# Altium project PCB_Project_sup_ca-.PrjPcb
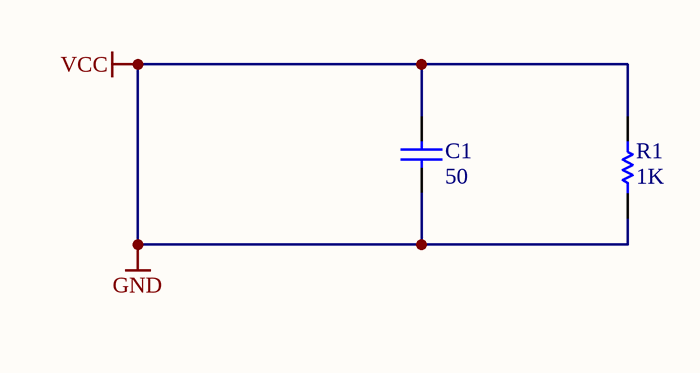
[diagram p0: sup_cap_RC circuit.SchDoc]
1 sheet, 2 parts. Net scope: global (net labels, ports and power ports of the same name join across sheets).

## Sheet sup_cap_RC circuit.SchDoc
size A4; SheetNumber: 1; SheetTotal: 1

### Parts
C1  value 50  (hidden comment: Capacitor)
R1  value 1K  (hidden comment: Resistor)

### Nets
GND: C1.1 C1.2 R1.1 R1.2  [also labelled VCC]

### Library data of the parts
C1 = Capacitor: SimulationGenericComponent: True
R1 = Resistor: TC1: 0; SimulationGenericComponent: True; TC2: 0